# Altium schematic sheet GSM_UNIT.SchDoc
size A4
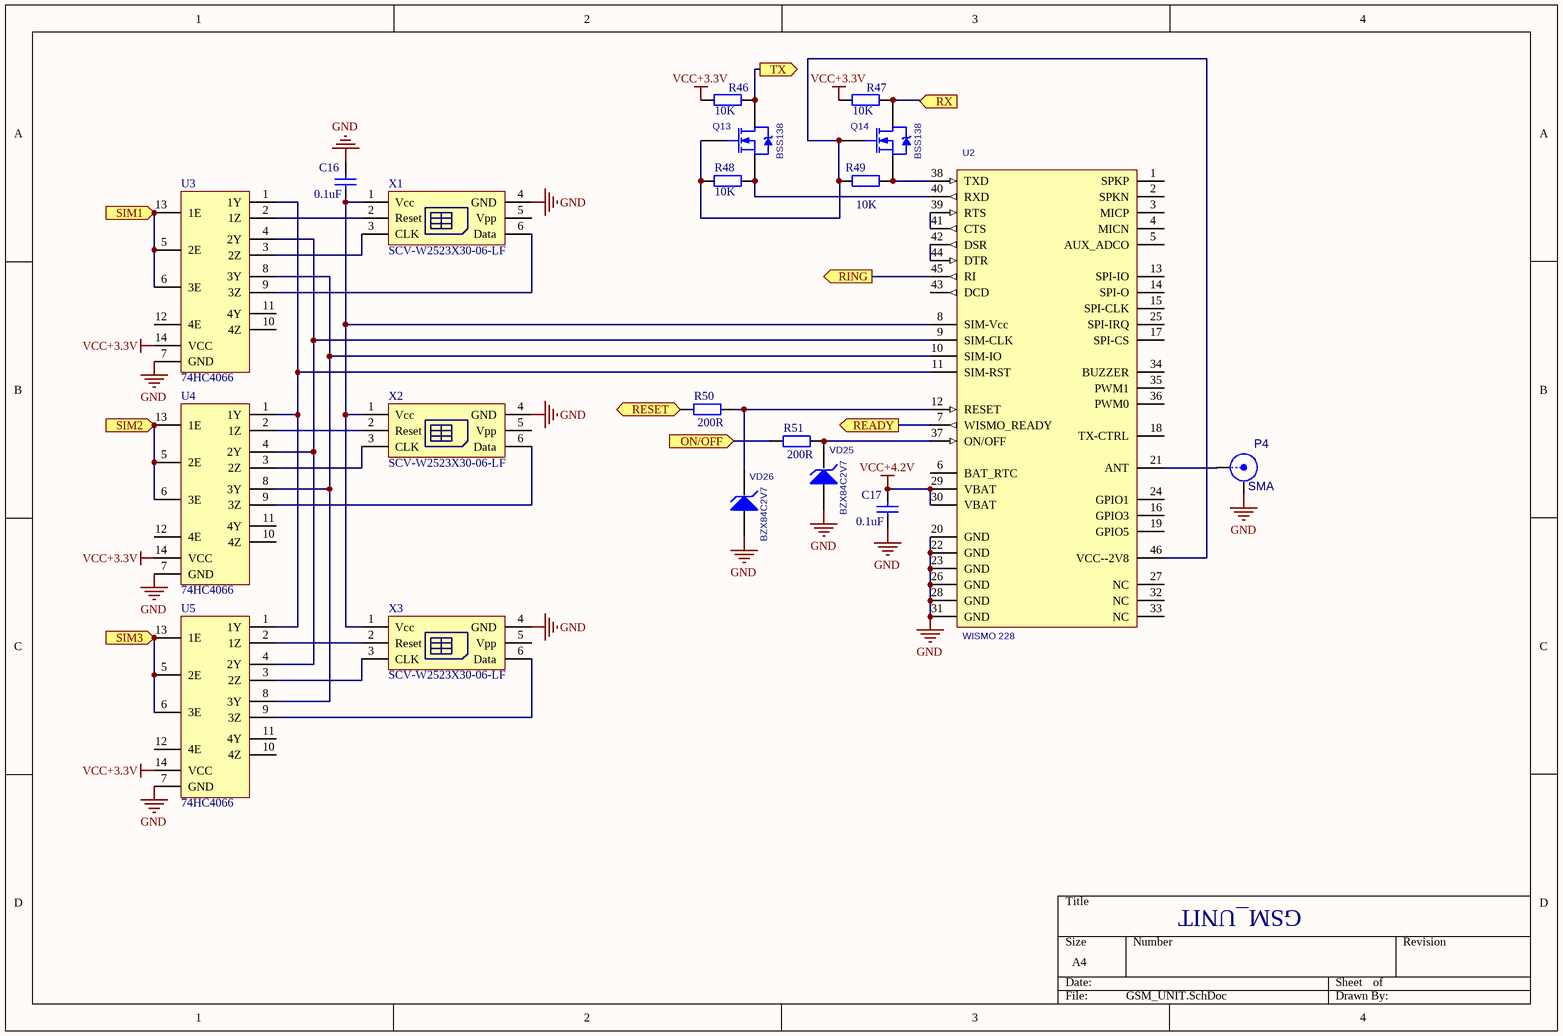
[diagram p0: GSM_UNIT.SchDoc]

## Parts
C16  value 0.1uF  [C0603]  (hidden comment: 0805)
C17  value 0.1uF  [C0603]  (hidden comment: 0805)
P4  SMA  [SMA]
Q13  BSS138  [SOT23]
Q14  BSS138  [SOT23]
R46  value 10K  [C0603]  (hidden comment: RES)
R47  value 10K  [C0603]  (hidden comment: RES)
R48  value 10K  [C0603]  (hidden comment: RES)
R49  value 10K  [C0603]  (hidden comment: RES)
R50  value 200R  [C0603]  (hidden comment: RES)
R51  value 200R  [C0603]  (hidden comment: RES)
U2  WISMO 228  [WISMO]
U3  74HC4066  [SO-14]
U4  74HC4066  [SO-14]
U5  74HC4066  [SO-14]
VD25  BZX84C2V7  [SOT23]
VD26  BZX84C2V7  [SOT23]
X1  SCV-W2523X30-06-LF  [SCV-W2523X30-06-LF]
X2  SCV-W2523X30-06-LF  [SCV-W2523X30-06-LF]
X3  SCV-W2523X30-06-LF  [SCV-W2523X30-06-LF]

## Ports
ON/OFF (in), READY (out), RESET (in), RING (out), RX (in), SIM1 (in), SIM2 (in), SIM3 (in), TX (out)

## Nets
GND: C16.1 C17.2 P4.2(Y) U2.20(GND) U2.22(GND) U2.23(GND) U2.26(GND) U2.28(GND) U2.31(GND) U3.7(GND) U4.7(GND) U5.7(GND) VD25.1(A) VD26.1(A) X1.4(GND) X2.4(GND) X3.4(GND)
VCC+3.3V: R46.1 R47.1 U3.14(VCC) U4.14(VCC) U5.14(VCC)
VCC+4.2V: C17.1 U2.29(VBAT) U2.30(VBAT)
ON/OFF: R51.1 ; port ON/OFF
READY: U2.7(WISMO_READY) ; port READY
RESET: R50.1 ; port RESET
RING: U2.45(RI) ; port RING
RX: Q14.3(D) R47.2 ; port RX
SIM1: U3.5(2E) U3.6(3E) U3.13(1E) ; port SIM1
SIM2: U4.5(2E) U4.6(3E) U4.13(1E) ; port SIM2
SIM3: U5.5(2E) U5.6(3E) U5.13(1E) ; port SIM3
TX: Q13.3(D) R46.2 ; port TX
NetC16_2: C16.2 U2.8(SIM-Vcc) X1.1(Vcc) X2.1(Vcc) X3.1(Vcc)
NetP4_1: P4.1(X) U2.21(ANT)
NetQ13_1: Q13.1(G) Q14.1(G) R48.1 R49.1 U2.46(VCC--2V8)
NetQ13_2: Q13.2(S) R48.2 U2.40(RXD)
NetQ14_2: Q14.2(S) R49.2 U2.38(TXD)
NetR50_2: R50.2 U2.12(RESET) VD26.3(K)
NetR51_2: R51.2 U2.37(ON/OFF) VD25.3(K)
NetU2_9: U2.9(SIM-CLK) U3.4(2Y) U4.4(2Y) U5.4(2Y)
NetU2_10: U2.10(SIM-IO) U3.8(3Y) U4.8(3Y) U5.8(3Y)
NetU2_11: U2.11(SIM-RST) U3.1(1Y) U4.1(1Y) U5.1(1Y)
NetU2_39: U2.39(RTS) U2.41(CTS)
NetU2_42: U2.42(DSR) U2.44(DTR)
NetU3_2: U3.2(1Z) X1.2(Reset)
NetU3_3: U3.3(2Z) X1.3(CLK)
NetU3_9: U3.9(3Z) X1.6(Data)
NetU4_2: U4.2(1Z) X2.2(Reset)
NetU4_3: U4.3(2Z) X2.3(CLK)
NetU4_9: U4.9(3Z) X2.6(Data)
NetU5_2: U5.2(1Z) X3.2(Reset)
NetU5_3: U5.3(2Z) X3.3(CLK)
NetU5_9: U5.9(3Z) X3.6(Data)

Not connected (* = marked no-connect by the designer): U2 1(SPKP) 2(SPKN) 3(MICP) 4(MICN) 5(AUX_ADCO) 6(BAT_RTC) 13(SPI-IO) 14(SPI-O) 15(SPI-CLK) 16(GPIO3) 17(SPI-CS) 18(TX-CTRL) 19(GPIO5) 24(GPIO1) 25(SPI-IRQ) 27(NC) 32(NC) 33(NC) 34(BUZZER) 35(PWM1) 36(PWM0) 43(DCD); U3 10(4Z) 11(4Y) 12(4E); U4 10(4Z) 11(4Y) 12(4E); U5 10(4Z) 11(4Y) 12(4E); VD25 2; VD26 2; X1 5(Vpp); X2 5(Vpp); X3 5(Vpp)

## Notes on the sheet
- GSM_UNIT

## Library data of the parts
C16 C17 = Capasitor_SMD_0805: Capasitor_SMD_0808/
Q13 Q14 = BSS138-SOT23
R46-R51 = RES: Resistor
VD25 VD26 = BZX84C: Value: *
X1-X3 = SCV-W2523X30-06-LF: SIM Cartreader
P4 = SMA: LatestRevisionDate: 17-Jul-2002; Publisher: Altium Limited; LatestRevisionNote: Re-released for DXP Platform.; Value: *